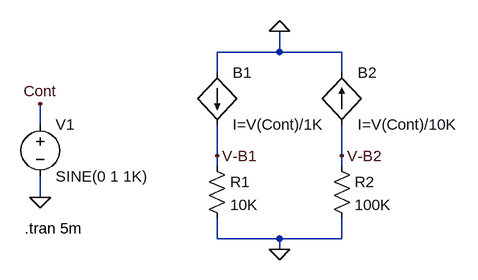
[diagram p0: schematic Fig_2-63_BI_BI2.asc]
Fig_2-63_BI_BI2.asc, the LTspice schematic file:
Version 4
SHEET 1 880 680
WIRE 256 96 256 64
WIRE 256 96 160 96
WIRE 352 96 256 96
WIRE 160 128 160 96
WIRE 352 128 352 96
WIRE -112 208 -112 176
WIRE 160 256 160 208
WIRE 352 256 352 208
WIRE 160 272 160 256
WIRE 352 272 352 256
WIRE -112 320 -112 288
WIRE 160 384 160 352
WIRE 256 384 160 384
WIRE 352 384 352 352
WIRE 352 384 256 384
WIRE 256 400 256 384
FLAG 256 400 0
FLAG -112 320 0
FLAG -112 176 Cont
FLAG 256 64 0
FLAG 160 256 V-B1
FLAG 352 256 V-B2
SYMBOL bi 160 128 R0
SYMATTR InstName B1
SYMATTR Value I=V(Cont)/1K
SYMBOL bi2 352 128 R0
SYMATTR InstName B2
SYMATTR Value I=V(Cont)/10K
SYMBOL res 144 256 R0
SYMATTR InstName R1
SYMATTR Value 10K
SYMBOL res 336 256 R0
SYMATTR InstName R2
SYMATTR Value 100K
SYMBOL voltage -112 192 R0
WINDOW 123 0 0 Left 2
WINDOW 39 0 0 Left 2
SYMATTR InstName V1
SYMATTR Value SINE(0 1 1K)
TEXT -136 368 Left 2 !.tran 5m

The netlist it stands for:
* Fig_2-63_BI_BI2.asc
B1 0 V-B1 I=V(Cont)/1K
B2 V-B2 0 I=V(Cont)/10K
R1 V-B1 0 10K
R2 V-B2 0 100K
V1 Cont 0 SINE(0 1 1K)
.tran 5m
.backanno
.end